# EAGLE schematic comparator (EAGLE 7.2.0)
CNAME: LM358N Comparator Example; CREVISION: 0.1; DESIGNER: dru / RNDC
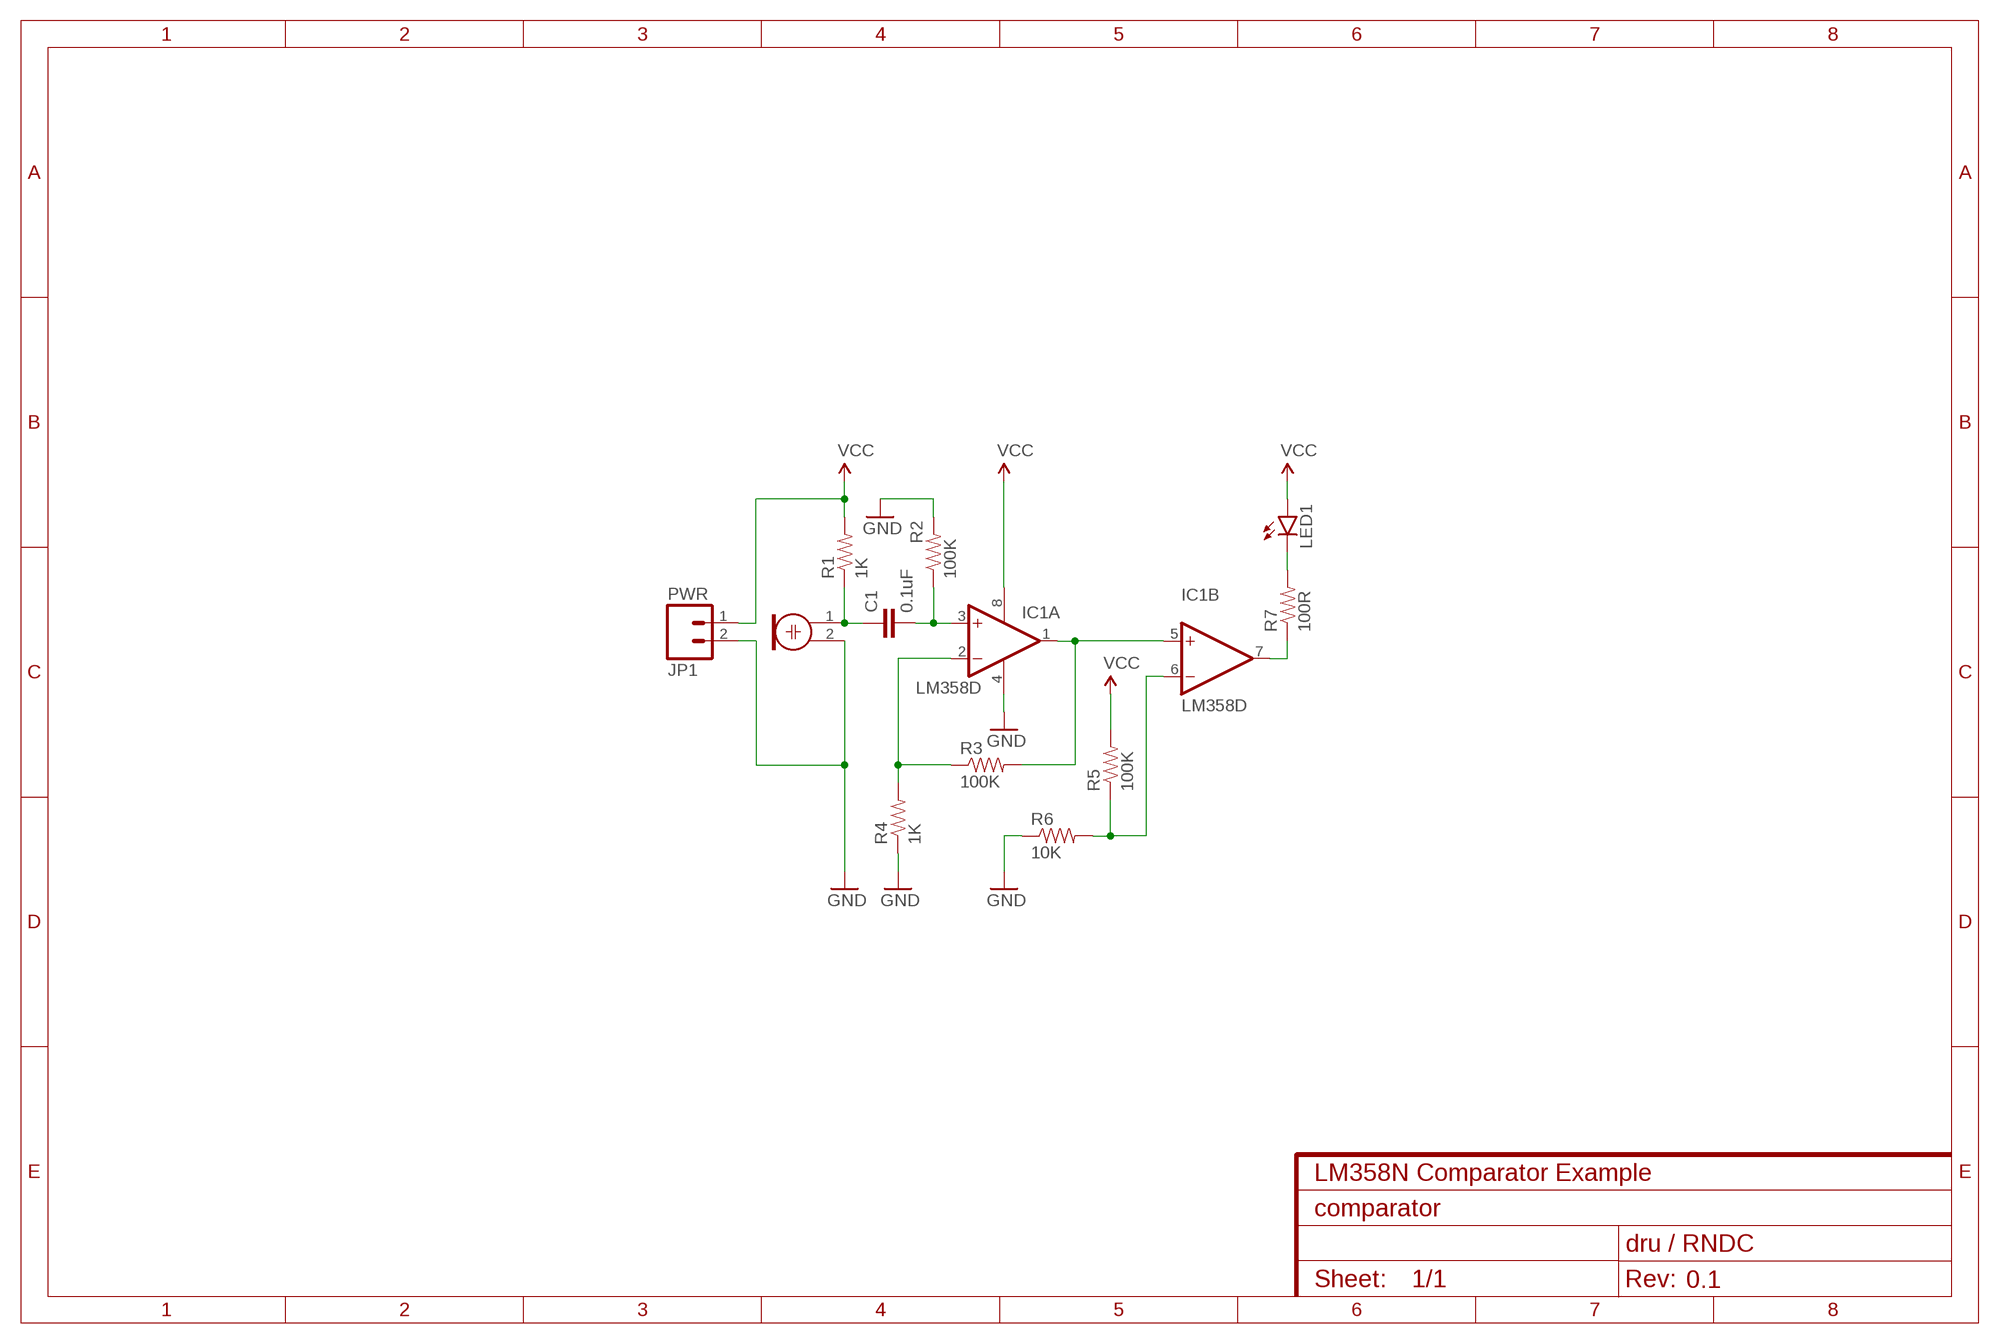
[diagram p0: schematic, sheet 1]

## Parts
C1  0.1uF  CAP0805  [0805]
IC1  LM358D  [SO08]
JP1  PWR  M02PTH  [1X02]
LED1  LED5MM  [LED5MM]
MIC  ELECTRET_MICROPHON-WM-61A  [WM-61A]
R1  1K  RESISTOR0603  [0603-RES]
R2  100K  RESISTOR0603  [0603-RES]
R3  100K  RESISTOR0603  [0603-RES]
R4  1K  RESISTOR0603  [0603-RES]
R5  100K  RESISTOR0603  [0603-RES]
R6  10K  RESISTOR0603  [0603-RES]
R7  100R  RESISTOR0603  [0603-RES]

## Nets
GND: IC1.4(P:V-) JP1.2 MIC.2 R2.2 R4.1 R6.1
N$1: C1.1 MIC.1 R1.1
N$2: LED1.K(C) R7.2
N$3: IC1.6(B:-IN) R5.1 R6.2
N$4: C1.2 IC1.3(A:+IN) R2.1
N$5: IC1.2(A:-IN) R3.1 R4.2
N$6: IC1.1(A:OUT) IC1.5(B:+IN) R3.2
N$7: IC1.7(B:OUT) R7.1
VCC: IC1.8(P:V+) JP1.1 LED1.A R1.2 R5.2

## Library data of the parts
C1 = SparkFun-Capacitors:CAP: Capacitor Standard 0603 ceramic capacitor, and 0.1" leaded capacitor.
IC1 = linear:LM358: OP AMP also LM158; LM258; LM2904 Source: http://cache.national.com/ds/LM/LM158.pdf
JP1 = SparkFun-Connectors:M02: Standard 2-pin 0.1" header. Use with - straight break away headers ( PRT-00116) - right angle break away headers (PRT-00553) - swiss pins (PRT-00743) - machine pins (PRT-00117) - female headers (PRT-00115) Molex polarized connector foot print use with: PRT-08233 with associated crimp pins and housings. 2.54_SCREWTERM for use with PRT-10571. 3.5mm Screw Terminal footprints for PRT-08084 5mm Screw Terminal footprints for use with PRT-08432
LED1 = SparkFun-LED:LED: LEDs Standard schematic elements and footprints for 5mm, 3mm, 1206, and 0603 sized LEDs. 5mm - Spark Fun Electronics SKU : COM-00529 (and others)
MIC = microphon:ELECTRET_MICROPHON-: Electret Condenser Microphone
R1-R7 = SparkFun-Resistors:RESISTOR: Resistor Basic schematic elements and footprints for 0603, 1206, and PTH resistors.